# Altium schematic sheet TWindow.SchDoc: LiveDesign Evaluation - EvalBoard Tester
size A4; Organization: Altium Limited; Address1: L3, 12a Rodborough Rd; Address2: Frenchs Forest; Address3: NSW; Address4: Australia 2086; DocumentNumber: 16; SheetNumber: 16; SheetTotal: 16
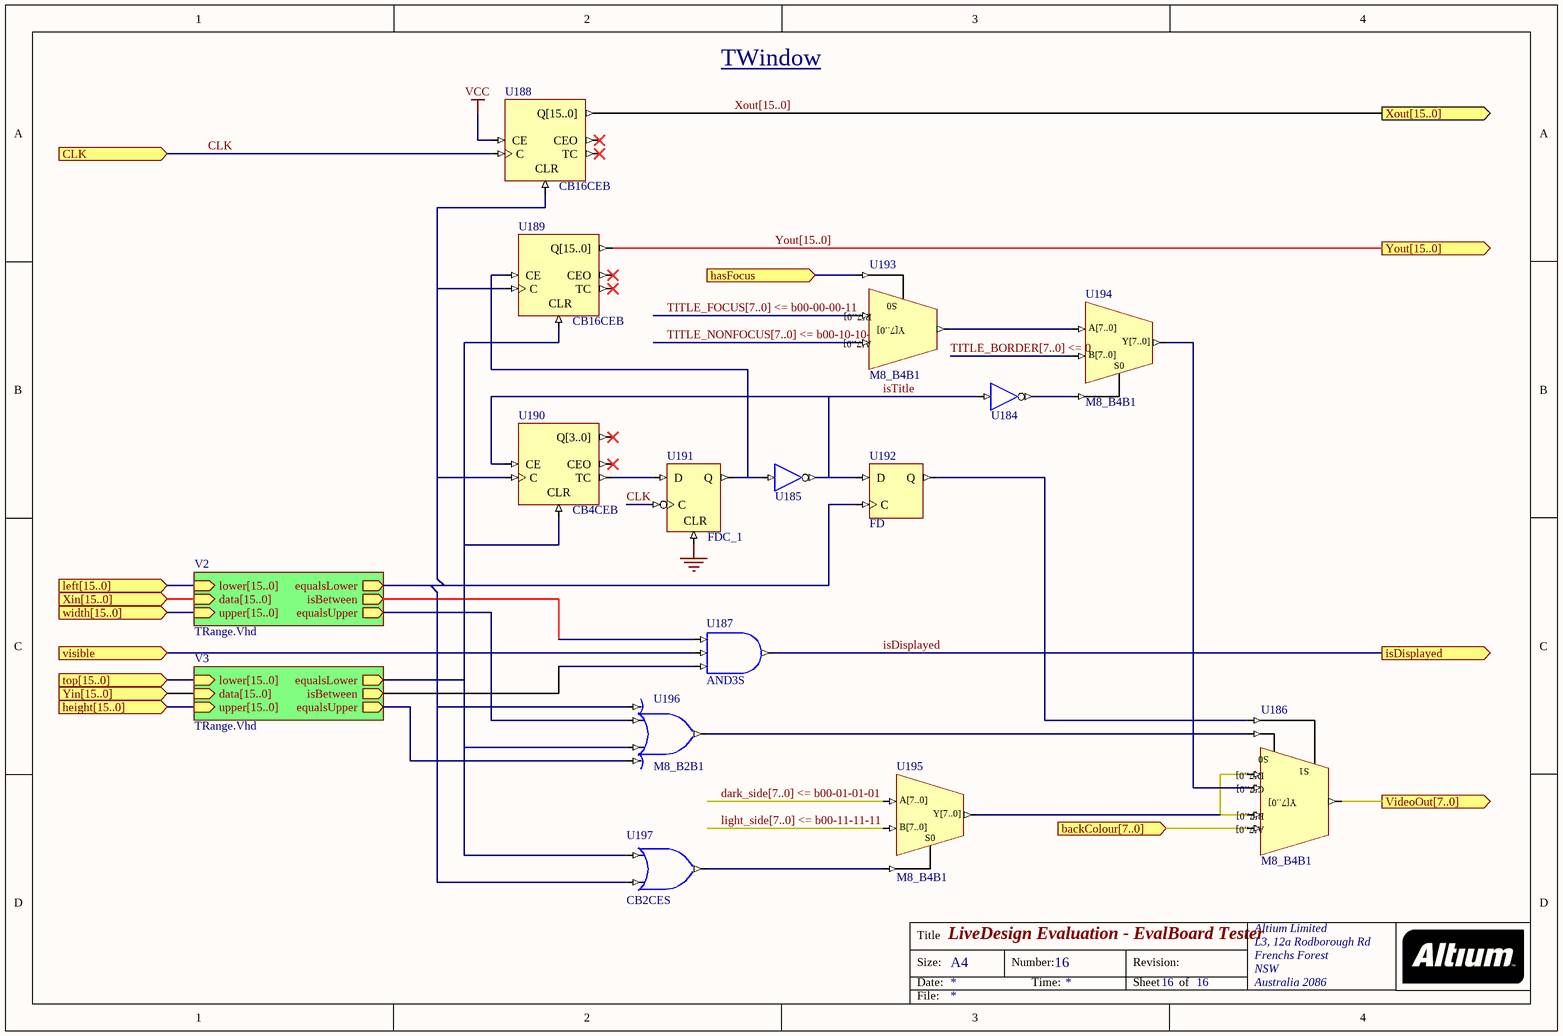
[diagram p0: TWindow.SchDoc]

## Parts
U184  INV  (value not drawn)
U185  INV  (value not drawn)
U186  M8_B4B1
U187  AND3S
U188  CB16CEB
U189  CB16CEB
U190  CB4CEB
U191  FDC_1
U192  FD
U193  M8_B4B1
U194  M8_B4B1
U195  M8_B4B1
U196  M8_B2B1
U197  CB2CES

## Sub-sheets
V2 = TRange.Vhd: lower[15..0] (in), data[15..0] (in), upper[15..0] (in), isBetween (out), equalsLower (out), equalsUpper (out)
V3 = TRange.Vhd: lower[15..0] (in), data[15..0] (in), upper[15..0] (in), isBetween (out), equalsLower (out), equalsUpper (out)

## Ports
backColour[7..0] (in), CLK (in), hasFocus (in), height[15..0] (in), isDisplayed (out), left[15..0] (in), top[15..0] (in), VideoOut[7..0] (out), visible (in), width[15..0] (in), Xin[15..0] (in), Xout[15..0] (out), Yin[15..0] (in), Yout[15..0] (out)

## Nets
GND: U191.CLR
VCC: U188.CE
backColour[7..0]: U186.A[7..0] ; port backColour[7..0]
CLK: U188.C U191.C ; port CLK
dark_side[7..0] <= b00-01-01-01: U195.A[7..0]
hasFocus: U193.S0 ; port hasFocus
isDisplayed: U187.O ; port isDisplayed
isTitle: U184.I U185.O U190.CE U192.D
light_side[7..0] <= b00-11-11-11: U195.B[7..0]
TITLE_BORDER[7..0] <= 0: U194.B[7..0]
TITLE_FOCUS[7..0] <= b00-00-00-11: U193.B[7..0]
TITLE_NONFOCUS[7..0] <= b00-10-10-10: U193.A[7..0]
VideoOut[7..0]: U186.Y[7..0] ; port VideoOut[7..0]
visible: U187.I1 ; port visible
Xout[15..0]: U188.Q[15..0] ; port Xout[15..0]
Yout[15..0]: U189.Q[15..0] ; port Yout[15..0]
NetU184_O: U184.O U194.S0
NetU185_I: U185.I U189.CE U191.Q
NetU186_B[7..0]: U186.B[7..0] U186.D[7..0] U195.Y[7..0]
NetU186_C[7..0]: U186.C[7..0] U194.Y[7..0]
NetU186_S0: U186.S0 U196.O
NetU186_S1: U186.S1 U192.Q
NetU187_I0: U187.I0 ; sheet V2/isBetween
NetU187_I2: U187.I2 ; sheet V3/isBetween
NetU188_CLR: U188.CLR U189.C U190.C U192.C U196.I0 U197.I1 ; sheet V2/equalsLower
NetU189_CLR: U189.CLR U190.CLR U196.I2 U197.I0 ; sheet V3/equalsLower
NetU190_TC: U190.TC U191.D
NetU193_Y[7..0]: U193.Y[7..0] U194.A[7..0]
NetU195_S0: U195.S0 U197.O
NetU196_I1: U196.I1 ; sheet V2/equalsUpper
NetU196_I3: U196.I3 ; sheet V3/equalsUpper

Not connected (* = marked no-connect by the designer): U188 CEO* TC*; U189 CEO* TC*; U190 CEO* Q[3..0]*

## Buses and harness runs
bus dark_side[7..0] <= b00-01-01-01
bus light_side[7..0] <= b00-11-11-11
bus port height[15..0] = sheet V3/upper[15..0]
bus port left[15..0] = sheet V2/lower[15..0]
bus port top[15..0] = sheet V3/lower[15..0]
bus port width[15..0] = sheet V2/upper[15..0]
bus port Xin[15..0] = sheet V2/data[15..0]
bus port Yin[15..0] = sheet V3/data[15..0]
bus TITLE_BORDER[7..0] <= 0
bus TITLE_FOCUS[7..0] <= b00-00-00-11
bus TITLE_NONFOCUS[7..0] <= b00-10-10-10
bus Xout[15..0] = port Xout[15..0]
bus Yout[15..0] = port Yout[15..0]

## Notes on the sheet
- TWindow
- Title
- Size:
- Date:
- A4
- Number:
- Time:
- Revision:
- Sheet
- of
- File:

## Library data of the parts
U184 U185 = INV: Inverter; ArchiveName: GENERIC; VHDLIB_SIM: GENERIC_LIB; Published: 29-Jan-2004; Publisher: Altium Limited; Xilinx Equivalent: INV; Core Revision: 1.00.00
U186 = M8_B4B1: 4x8-Bit Bus to 1x8-Bit Bus Multiplexer; ArchiveName: GENERIC; VHDLIB_SIM: GENERIC_LIB; Published: 29-Jan-2004; Publisher: Altium Limited; Core Revision: 1.00.00
U187 = AND3S: 3-Input AND Gate, Single Pin Version; Xilinx Equivalent: AND3; ArchiveName: GENERIC; VHDLIB_SIM: GENERIC_LIB; Published: 29-Jan-2004; Publisher: Altium Limited; Core Revision: 1.00.00
U188 U189 = CB16CEB: 16-Bit Cascadable Binary Counters with Clock Enable and Asynchronous Clear, Bus Version; Xilinx Equivalent: CB16CE; ArchiveName: GENERIC; VHDLIB_SIM: GENERIC_LIB; Published: 29-Jan-2004; Publisher: Altium Limited; Core Revision: 1.00.00
U190 = CB4CEB: 4-Bit Cascadable Binary Counters with Clock Enable and Asynchronous Clear, Bus Version; ArchiveName: GENERIC; VHDLIB_SIM: GENERIC_LIB; Published: 29-Jan-2004; Publisher: Altium Limited; Core Revision: 1.00.00
U191 = FDC_1: D-Type Negative Edge Flip-Flop with Asynchronous Clear; ArchiveName: GENERIC; VHDLIB_SIM: GENERIC_LIB; Published: 29-Jan-2004; Publisher: Altium Limited; Xilinx Equivalent: FDC_1; Core Revision: 1.00.00
U192 = FD: D-Type Flip-Flop; ArchiveName: GENERIC; VHDLIB_SIM: GENERIC_LIB; Published: 29-Jan-2004; Publisher: Altium Limited; Xilinx Equivalent: FD; Core Revision: 1.00.00
U193-U195 = M8_B2B1: 2x8-Bit Bus to 1x8-Bit Bus Multiplexer; ArchiveName: GENERIC; VHDLIB_SIM: GENERIC_LIB; Published: 29-Jan-2004; Publisher: Altium Limited; Core Revision: 1.00.00
U196 = OR4S: 4-Input OR Gate, Single Pin Version; Xilinx Equivalent: OR4; ArchiveName: GENERIC; VHDLIB_SIM: GENERIC_LIB; Published: 29-Jan-2004; Publisher: Altium Limited; Core Revision: 1.00.00
U197 = OR2S: 2-Input OR Gate, Single Pin Version; Xilinx Equivalent: OR2; ArchiveName: GENERIC; VHDLIB_SIM: GENERIC_LIB; Published: 29-Jan-2004; Publisher: Altium Limited; Core Revision: 1.00.00